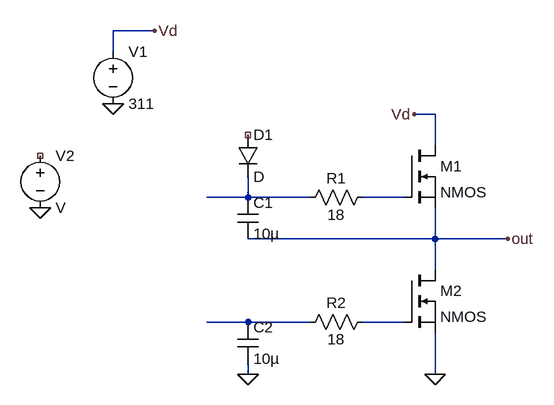
[diagram p0: schematic ideal.asc]
ideal.asc, the LTspice schematic file:
Version 4
SHEET 1 880 680
WIRE -112 -128 -176 -128
WIRE -176 -96 -176 -128
WIRE 320 0 288 0
WIRE 320 48 320 0
WIRE 32 128 32 96
WIRE 32 128 -32 128
WIRE 128 128 32 128
WIRE 272 128 208 128
WIRE 320 192 320 144
WIRE 320 192 32 192
WIRE 432 192 320 192
WIRE 320 240 320 192
WIRE 32 320 -32 320
WIRE 128 320 32 320
WIRE 272 320 208 320
WIRE 32 400 32 384
WIRE 320 400 320 336
FLAG -176 -16 0
FLAG -112 -128 Vd
FLAG 288 0 Vd
FLAG 432 192 out
FLAG 32 400 0
FLAG 320 400 0
FLAG -288 144 0
SYMBOL nmos 272 48 R0
SYMATTR InstName M1
SYMBOL nmos 272 240 R0
SYMATTR InstName M2
SYMBOL voltage -176 -112 R0
WINDOW 123 0 0 Left 0
WINDOW 39 0 0 Left 0
SYMATTR InstName V1
SYMATTR Value 311
SYMBOL res 224 112 R90
WINDOW 0 2 56 VBottom 2
WINDOW 3 27 56 VTop 2
SYMATTR InstName R1
SYMATTR Value 18
SYMBOL res 224 304 R90
WINDOW 0 2 56 VBottom 2
WINDOW 3 27 56 VTop 2
SYMATTR InstName R2
SYMATTR Value 18
SYMBOL cap 16 128 R0
SYMATTR InstName C1
SYMATTR Value 10µ
SYMBOL cap 16 320 R0
SYMATTR InstName C2
SYMATTR Value 10µ
SYMBOL diode 16 32 R0
SYMATTR InstName D1
SYMBOL voltage -288 48 R0
SYMATTR InstName V2

The netlist it stands for:
* ideal.asc
M1 Vd N002 out out NMOS
M2 out N004 0 0 NMOS
V1 Vd 0 311
R1 N002 N001 18
R2 N004 N003 18
C1 N001 out 10µ
C2 N003 0 10µ
D1 NC_01 N001 D
V2 NC_02 0 V
.model D D
.lib standard.dio
.model NMOS NMOS
.model PMOS PMOS
.lib standard.mos
.backanno
.end